# Altium schematic sheet XH-4A.schdoc
size 127 x 101 mm
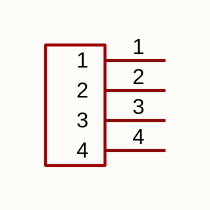
[diagram p0: XH-4A.schdoc]

## Parts
CN?  xh-4a_c37815  [CONN-TH_4P-P2.50_XH-4A]  (value not drawn)

## Nets

Not connected (* = marked no-connect by the designer): CN? 1 2 3 4

## Library data of the parts
CN? = xh-4a_c37815: 插针结构:1x4P;间距:2.5mm;安装方式:直插;参考系列:XH;总PIN数:4P;排数:1;每排PIN数:4;行距:-;额定电流:-;触头材质:-;触头镀层:-;工作温度:-;; Manufacturer: BOOMELE(博穆精密); Symbol: XH-4A; AddInBom: yes; ModelId: 5fb049f4745545a5b3e6d8e7931866fa; ModelTransform: 492.125,224.409,0,180,0,0,0,17.913,-98.425; Pins Structure: 1x4P; Pitch: 2.5mm; Reference Series: XH; Number of PINs Per Row: 4; Z-Height of the Board: 7mm; X-Length of Bottom Edge on Board (Spacing Line): 12.5mm; Y-Width of Bottom Edge on Board: 5.8mm; LCSC Part Name: 1x4P 间距:2.5mm 直插 系列:XH; SupplierPart: C37815; ManufacturerPart: XH-4A; Supplier Footprint: 插件,P=2.5mm; JLCPCB Part Class: Extended Part; Datasheet: https://item.szlcsc.com/datasheet/XH-4A/38795.html; Supplier: LCSC; ConvertToPcb: yes; FootprintName: CONN-TH_4P-P2.50_XH-4A; ModelName: CONN-TH_4P-P2.50_XH-4A; Mounting Type: 直插; Number of Pins: 4P; Number of Rows: 1; Row Spacing: -; Current Rating: -; Contact Material: -; Contact Plating: -; Operating Temperature: -; Voltage Rating: -; Plastic Material: -; Flame Retardant Rating: -; Supplementary Features: -; Color: 白色